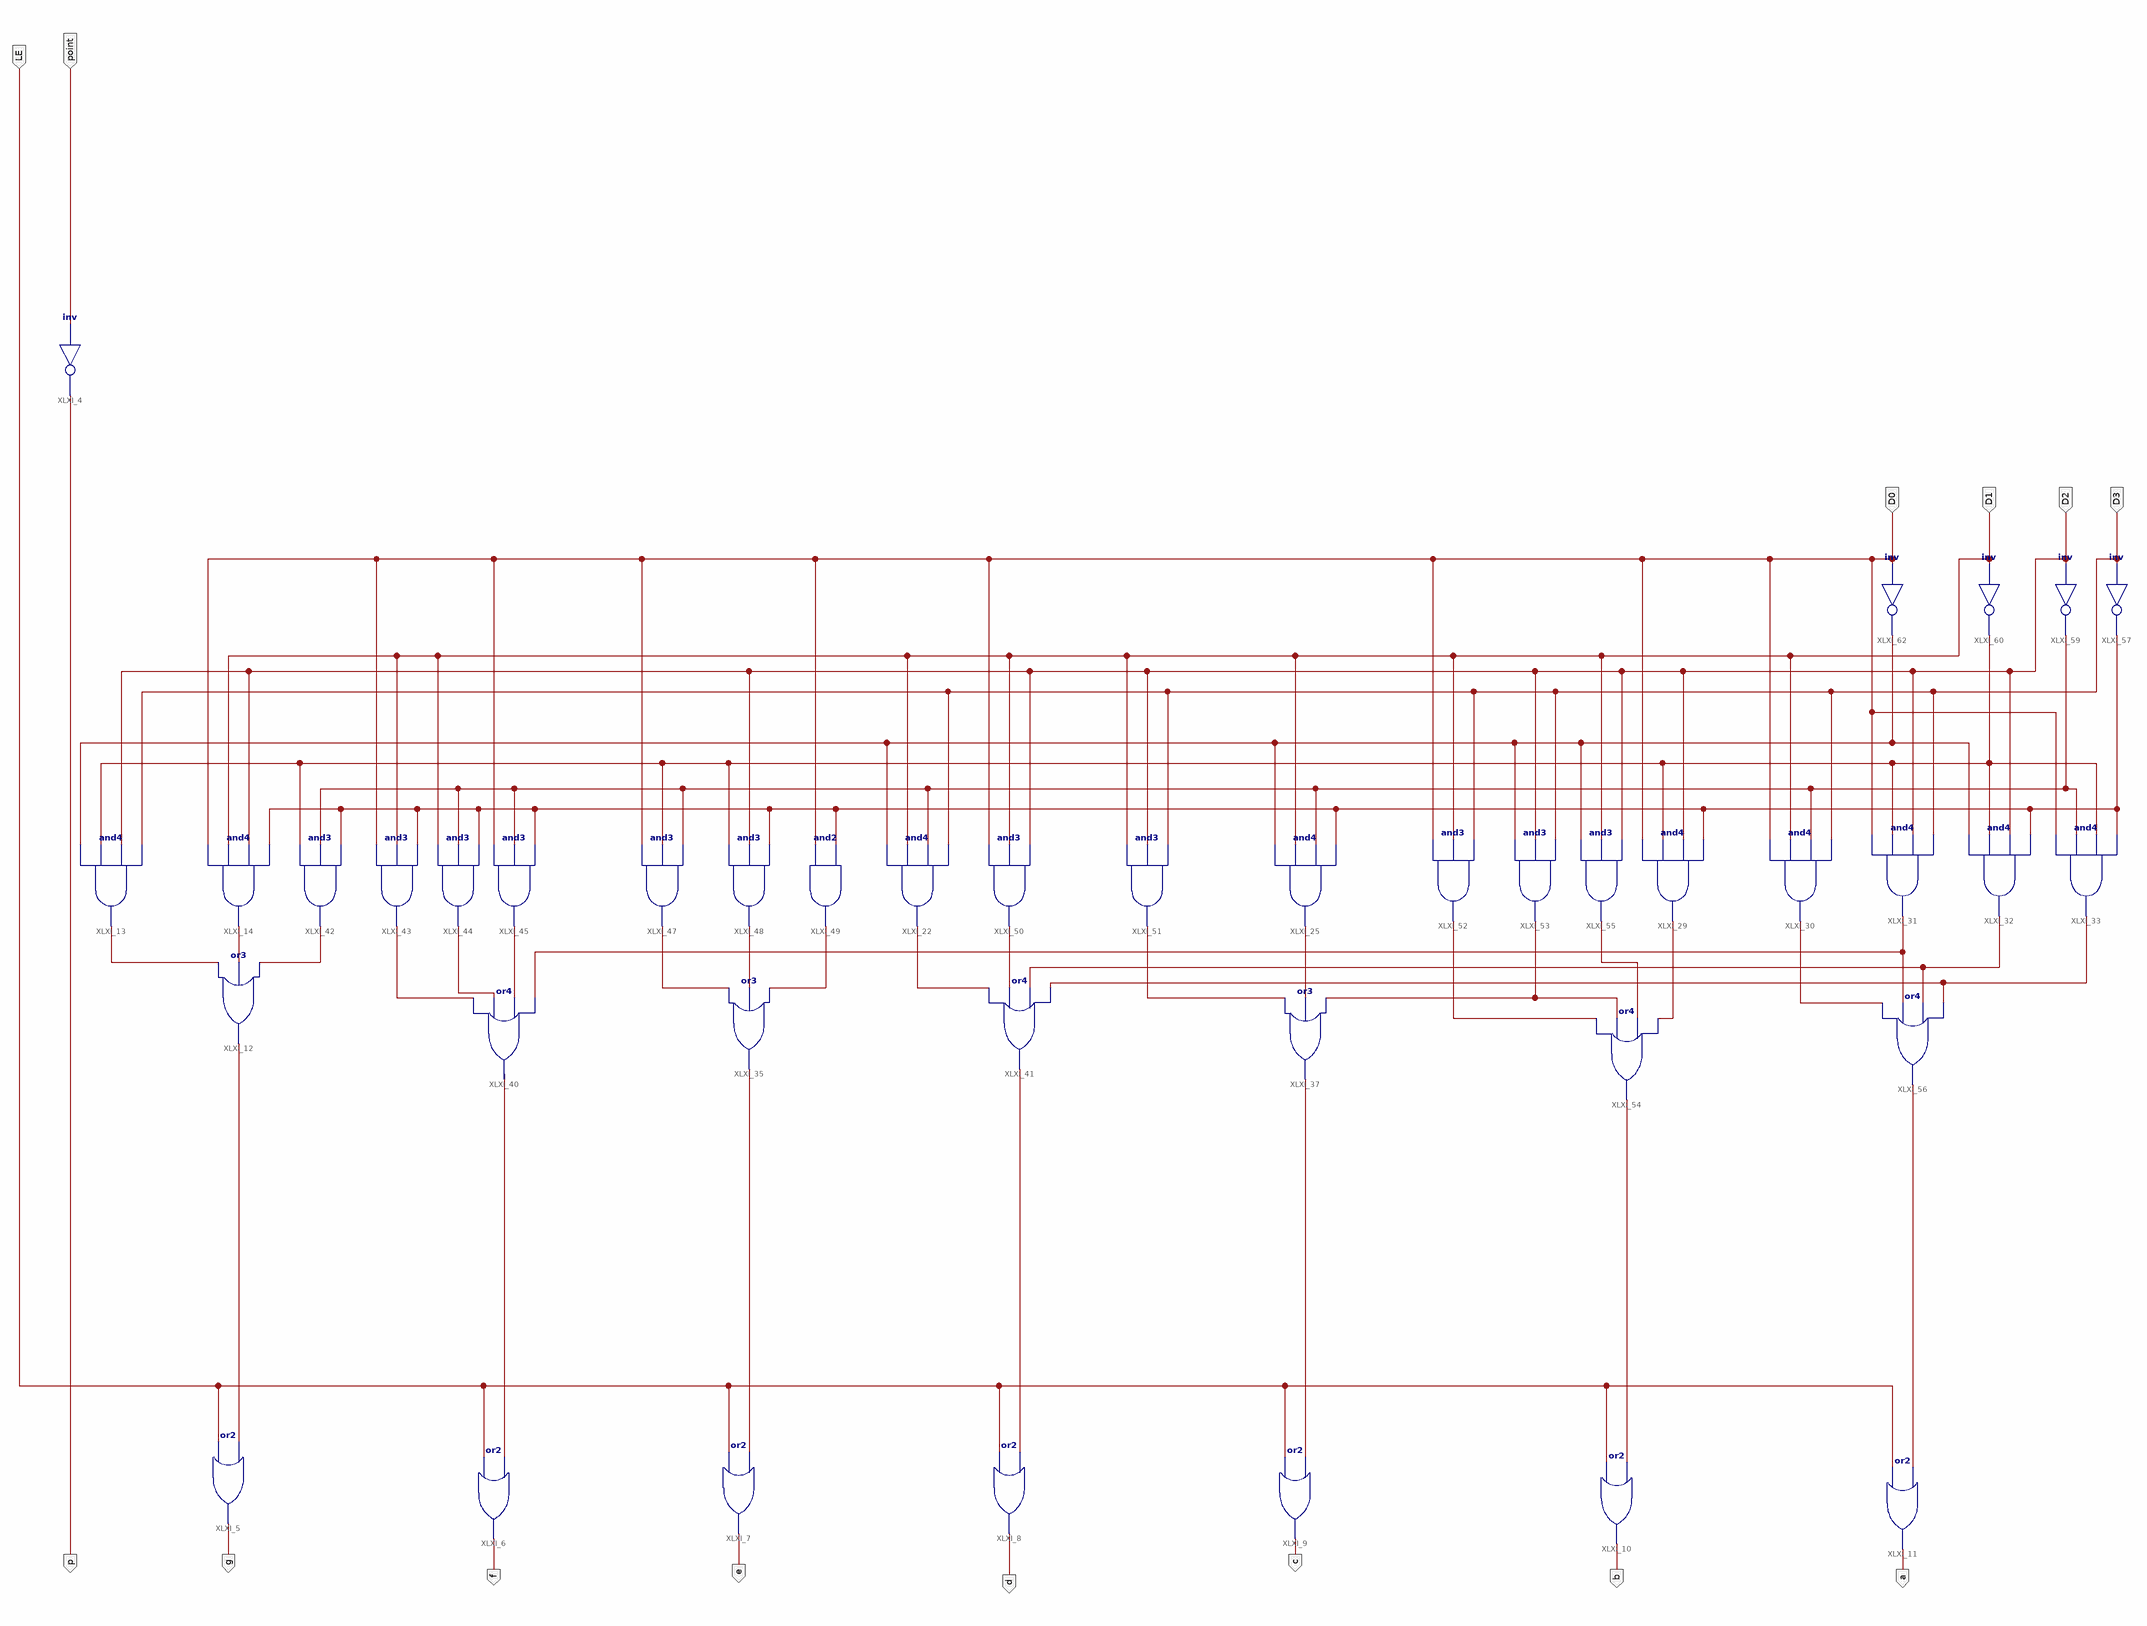
[diagram p0: schematic sheet 1]
// Xilinx ISE schematic MyMC14495.sch (kintex7) as structural Verilog: 40 symbols, 14 ports
module MyMC14495 (
  input  point,
  input  LE,
  input  D3,
  input  D2,
  input  D1,
  input  D0,
  output p,
  output g,
  output f,
  output e,
  output d,
  output c,
  output b,
  output a
);

  wire XLXN_13, XLXN_20, XLXN_21, XLXN_22, XLXN_23, XLXN_24, XLXN_25, XLXN_26, XLXN_27, XLXN_37, XLXN_38,
       XLXN_39, XLXN_41, XLXN_42, XLXN_43, XLXN_44, XLXN_50, XLXN_52, XLXN_53, XLXN_54, XLXN_55, XLXN_56,
       XLXN_57, XLXN_58, XLXN_61, XLXN_62, XLXN_64, XLXN_66, XLXN_69, XLXN_72, XLXN_73, XLXN_76;

  not XLXI_4 (p, point);
  or XLXI_5 (g, LE, XLXN_13);
  or XLXI_6 (f, LE, XLXN_20);
  or XLXI_7 (e, LE, XLXN_21);
  or XLXI_8 (d, LE, XLXN_22);
  or XLXI_9 (c, LE, XLXN_23);
  or XLXI_10 (b, LE, XLXN_24);
  or XLXI_11 (a, LE, XLXN_25);
  or XLXI_12 (XLXN_13, XLXN_26, XLXN_27, XLXN_50);
  and XLXI_13 (XLXN_26, XLXN_76, XLXN_73, D2, D3);
  and XLXI_14 (XLXN_27, D0, D1, D2, XLXN_69);
  and XLXI_22 (XLXN_52, XLXN_76, D1, XLXN_72, D3);
  and XLXI_25 (XLXN_57, XLXN_76, D1, XLXN_72, XLXN_69);
  and XLXI_29 (XLXN_64, D0, XLXN_73, D2, XLXN_69);
  and XLXI_30 (XLXN_66, D0, D1, XLXN_72, D3);
  and XLXI_31 (XLXN_41, D0, XLXN_73, D2, D3);
  and XLXI_32 (XLXN_54, XLXN_76, XLXN_73, D2, XLXN_69);
  and XLXI_33 (XLXN_55, D0, XLXN_72, XLXN_73, XLXN_69);
  or XLXI_35 (XLXN_21, XLXN_42, XLXN_43, XLXN_44);
  or XLXI_37 (XLXN_23, XLXN_56, XLXN_57, XLXN_58);
  or XLXI_40 (XLXN_20, XLXN_37, XLXN_38, XLXN_39, XLXN_41);
  or XLXI_41 (XLXN_22, XLXN_52, XLXN_53, XLXN_54, XLXN_55);
  and XLXI_42 (XLXN_50, XLXN_73, XLXN_72, XLXN_69);
  and XLXI_43 (XLXN_37, D0, D1, XLXN_69);
  and XLXI_44 (XLXN_38, D1, XLXN_72, XLXN_69);
  and XLXI_45 (XLXN_39, D0, XLXN_72, XLXN_69);
  and XLXI_47 (XLXN_42, D0, XLXN_73, XLXN_72);
  and XLXI_48 (XLXN_43, XLXN_73, D2, XLXN_69);
  and XLXI_49 (XLXN_44, D0, XLXN_69);
  and XLXI_50 (XLXN_53, D0, D1, D2);
  and XLXI_51 (XLXN_56, D1, D2, D3);
  and XLXI_52 (XLXN_61, D0, D1, D3);
  and XLXI_53 (XLXN_58, XLXN_76, D2, D3);
  or XLXI_54 (XLXN_24, XLXN_61, XLXN_58, XLXN_62, XLXN_64);
  and XLXI_55 (XLXN_62, XLXN_76, D1, D2);
  or XLXI_56 (XLXN_25, XLXN_66, XLXN_41, XLXN_54, XLXN_55);
  not XLXI_57 (XLXN_69, D3);
  not XLXI_59 (XLXN_72, D2);
  not XLXI_60 (XLXN_73, D1);
  not XLXI_62 (XLXN_76, D0);
endmodule
